# Altium schematic sheet LO.SchDoc
size C
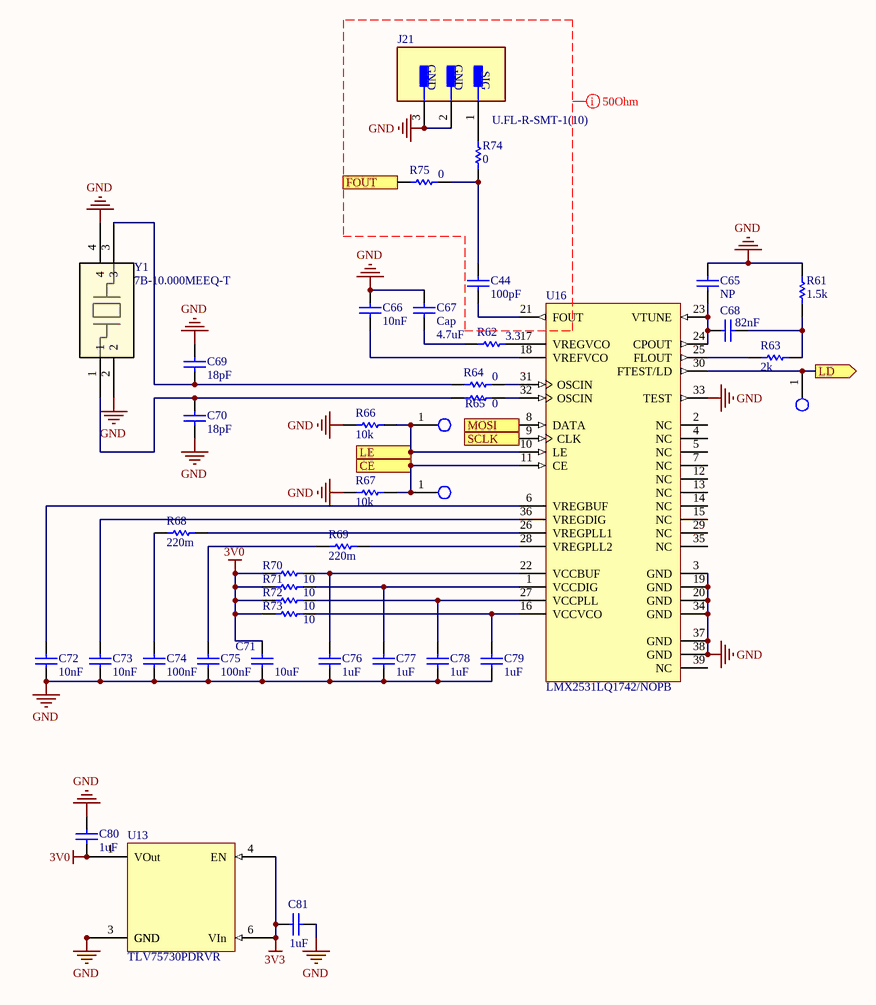
[diagram p0: LO.SchDoc]

## Parts
C44  value 100pF  [0402-A]  (hidden comment: Cap)
C65  value NP  [0402-A]  (hidden comment: Cap)
C66  value 10nF  [0402-A]  (hidden comment: Cap)
C67  Cap  value 4.7uF  [6-0805_M]
C68  value 82nF  [0402-A]  (hidden comment: Cap)
C69  value 18pF  [0402-A]  (hidden comment: Cap)
C70  value 18pF  [0402-A]  (hidden comment: Cap)
C71  value 10uF  [C1206]  (hidden comment: Cap)
C72  value 10nF  [0402-A]  (hidden comment: Cap)
C73  value 10nF  [0402-A]  (hidden comment: Cap)
C74  value 100nF  [0402-A]  (hidden comment: Cap)
C75  value 100nF  [0402-A]  (hidden comment: Cap)
C76  value 1uF  [1608[0603]]  (hidden comment: Cap)
C77  value 1uF  [1608[0603]]  (hidden comment: Cap)
C78  value 1uF  [1608[0603]]  (hidden comment: Cap)
C79  value 1uF  [1608[0603]]  (hidden comment: Cap)
C80  value 1uF  [1608[0603]]  (hidden comment: Cap)
C81  value 1uF  [1608[0603]]  (hidden comment: Cap)
CLK5  5029  [EXPOSED PAD 0.02X0.02]  (value not drawn)
CLK6  5029  [EXPOSED PAD 0.02X0.02]  (value not drawn)
CLK7  5029  [EXPOSED PAD 0.02X0.02]  (value not drawn)
J21  U.FL-R-SMT-1(10)  [FP-U_FL-R-SMT-1_10-MFG]
R61  value 1.5k  [0402-A]  (hidden comment: Res1)
R62  value 3.3  [0402-A]  (hidden comment: Res1)
R63  value 2k  [0402-A]  (hidden comment: Res1)
R64  value 0  [0402-A]  (hidden comment: Res1)
R65  value 0  [0402-A]  (hidden comment: Res1)
R66  value 10k  [0402-A]  (hidden comment: Res1)
R67  value 10k  [0402-A]  (hidden comment: Res1)
R68  value 220m  [0402-A]  (hidden comment: Res1)
R69  value 220m  [0402-A]  (hidden comment: Res1)
R70  value 10  [0402-A]  (hidden comment: Res1)
R71  value 10  [0402-A]  (hidden comment: Res1)
R72  value 10  [0402-A]  (hidden comment: Res1)
R73  value 10  [0402-A]  (hidden comment: Res1)
R74  value 0  [0402-A]  (hidden comment: Res1)
R75  value 0  [0402-A]  (hidden comment: Res1)
U13  TLV75730PDRVR  [TLV75730PDRVR]
U16  LMX2531LQ1742/NOPB  [NJG0036A_V]
Y1  7B-10.000MEEQ-T  [CRYSTAL_TXC_7B]

## Ports
CE (in), FOUT (out), LD (out), LE (in), MOSI (in), SCLK (in)

## Nets
3V0: C71.2 C80.2 R70.2 R71.2 R72.2 R73.2 U13.1(VOut)
3V3: C81.2 U13.4(EN) U13.6(VIn)
GND: C65.1 C66.2 C67.2 C69.2 C70.1 C71.1 C72.1 C73.1 C74.1 C75.1 C76.2 C77.2 C78.2 C79.2 C80.1 C81.1 J21.2(GND) J21.3(GND) R61.1 R66.1 R67.1 U13.3(GND) U13.7(GND) U16.3(GND) U16.19(GND) U16.20(GND) U16.33(TEST) U16.34(GND) U16.37(GND) U16.38(GND) Y1.2 Y1.4
CE: CLK7.1 R67.2 U16.11(CE) ; port CE
FOUT: R75.2 ; port FOUT
LD: CLK5.1 U16.30(FTEST/LD) ; port LD
LE: CLK6.1 R66.2 U16.10(LE) ; port LE
MOSI: U16.8(DATA) ; port MOSI
SCLK: U16.9(CLK) ; port SCLK
NetC44_1: C44.1 R74.2 R75.1
NetC44_2: C44.2 U16.21(FOUT)
NetC65_2: C65.2 C68.2 U16.23(VTUNE) U16.24(CPOUT)
NetC66_1: C66.1 U16.18(VREFVCO)
NetC67_1: C67.1 R62.2
NetC68_1: C68.1 R61.2 R63.2
NetC69_1: C69.1 R64.2 Y1.3
NetC70_2: C70.2 R65.2 Y1.1
NetC72_2: C72.2 U16.6(VREGBUF)
NetC73_2: C73.2 U16.36(VREGDIG)
NetC74_2: C74.2 R68.2
NetC75_2: C75.2 R69.2
NetC76_1: C76.1 R70.1 U16.22(VCCBUF)
NetC77_1: C77.1 R71.1 U16.1(VCCDIG)
NetC78_1: C78.1 R72.1 U16.27(VCCPLL)
NetC79_1: C79.1 R73.1 U16.16(VCCVCO)
NetJ21_1: J21.1(SIG) R74.1
NetR62_1: R62.1 U16.17(VREGVCO)
NetR63_1: R63.1 U16.25(FLOUT)
NetR64_1: R64.1 U16.31(OSCIN)
NetR65_1: R65.1 U16.32(OSCIN)
NetR68_1: R68.1 U16.26(VREGPLL1)
NetR69_1: R69.1 U16.28(VREGPLL2)

Not connected (* = marked no-connect by the designer): U16 2(NC) 4(NC) 5(NC) 7(NC) 12(NC) 13(NC) 14(NC) 15(NC) 29(NC) 35(NC) 39(NC)

## Layout directives
net class 50Ohm: GND

## Library data of the parts
C44 C65-C81 = Cap: Capacitor; Published: 8-Jun-2000; LatestRevisionDate: 17-Jul-2002; LatestRevisionNote: Re-released for DXP Platform.; PackageReference: RAD-0.3; Publisher: Altium Limited; PackageDescription: Radial Cap, Thru-Hole; 2 Leads; 0.3 in Pin Spacing
  C67: Supplier 1: Digi-Key; Supplier Part Number 1: 490-14466-1-ND
J21 = CMP-2000-05152-2: CONN U.FL RCPT STR 50 OHM SMD; Body Plating: Silver; Impedance: 50R; Frequency: 6GHz; Connector Type: Coaxial; Dielectric Material: Polymer; Insulation Resistance: 500MR; Body Material: Bronze; Gender: Male; REACH SVHC: No SVHC; Depth: 3.1mm; Housing Color: Beige; Contact Material: Brass; Package Quantity: 2500; Max Frequency: 6GHz; Radiation Hardening: No; Packaging: Tape and Reel; Termination: Solder; Lead Free: Lead Free; Wire/Cable Type: Coaxial; Min Operating Temperature: -40°C; Max Operating Temperature: 90°C; Contact Plating: Gold; Mount: Surface Mount; Fastening Type: Snap; Orientation: Straight; Length: 3mm
R61-R75 = Res1: Resistor; Published: 8-Jun-2000; LatestRevisionDate: 17-Jul-2002; LatestRevisionNote: Re-released for DXP Platform.; PackageReference: AXIAL-0.3; Publisher: Altium Limited; PackageDescription: Axial Device, Thru-Hole; 2 Leads; 0.3 in Pin Spacing
U16 = CMP-0058-00556-3: High Performance Frequency Synthesizer System with Integrated VCO, 36-pin LLP, Pb-Free; Manufacturer: Texas Instruments; CompType: Interface IC; PowerWise: Y; PackageTopMarking: NS*UZXYTTE#*311742A; RoHS: Y; PinCount: 36; PackageDescription: LLP, Plastic, Quad, 6 x 6 x 0.8mm Body, 36 Lead, 0.5mm Pitch, Custom; ComponentLink1URL: http://www.ti.com/general/docs/lit/getliterature.tsp?genericPartNumber=LMX2531&fileType=pdf; ComponentLink1Description: Datasheet URL; PackageReference: NJG0036A
Y1 = 7B-10.000MEEQ-T: No Description Available; Vendor: TXC; Built_By: EMA_UL_Team; Manufacturer_Part_Number: 7B-10.000MEEQ-T; Copyright: Copyright (C) 2018 Accelerated Designs. All rights reserved; RefDes: RefDes; Type: DEV